# EasyEDA schematic Photogate1.json
TITLE: Sheet_1; REV: 1.0; Date: 2023-07-29; Sheet: 1/1; Drawn By: iwmain; Company: Your Company
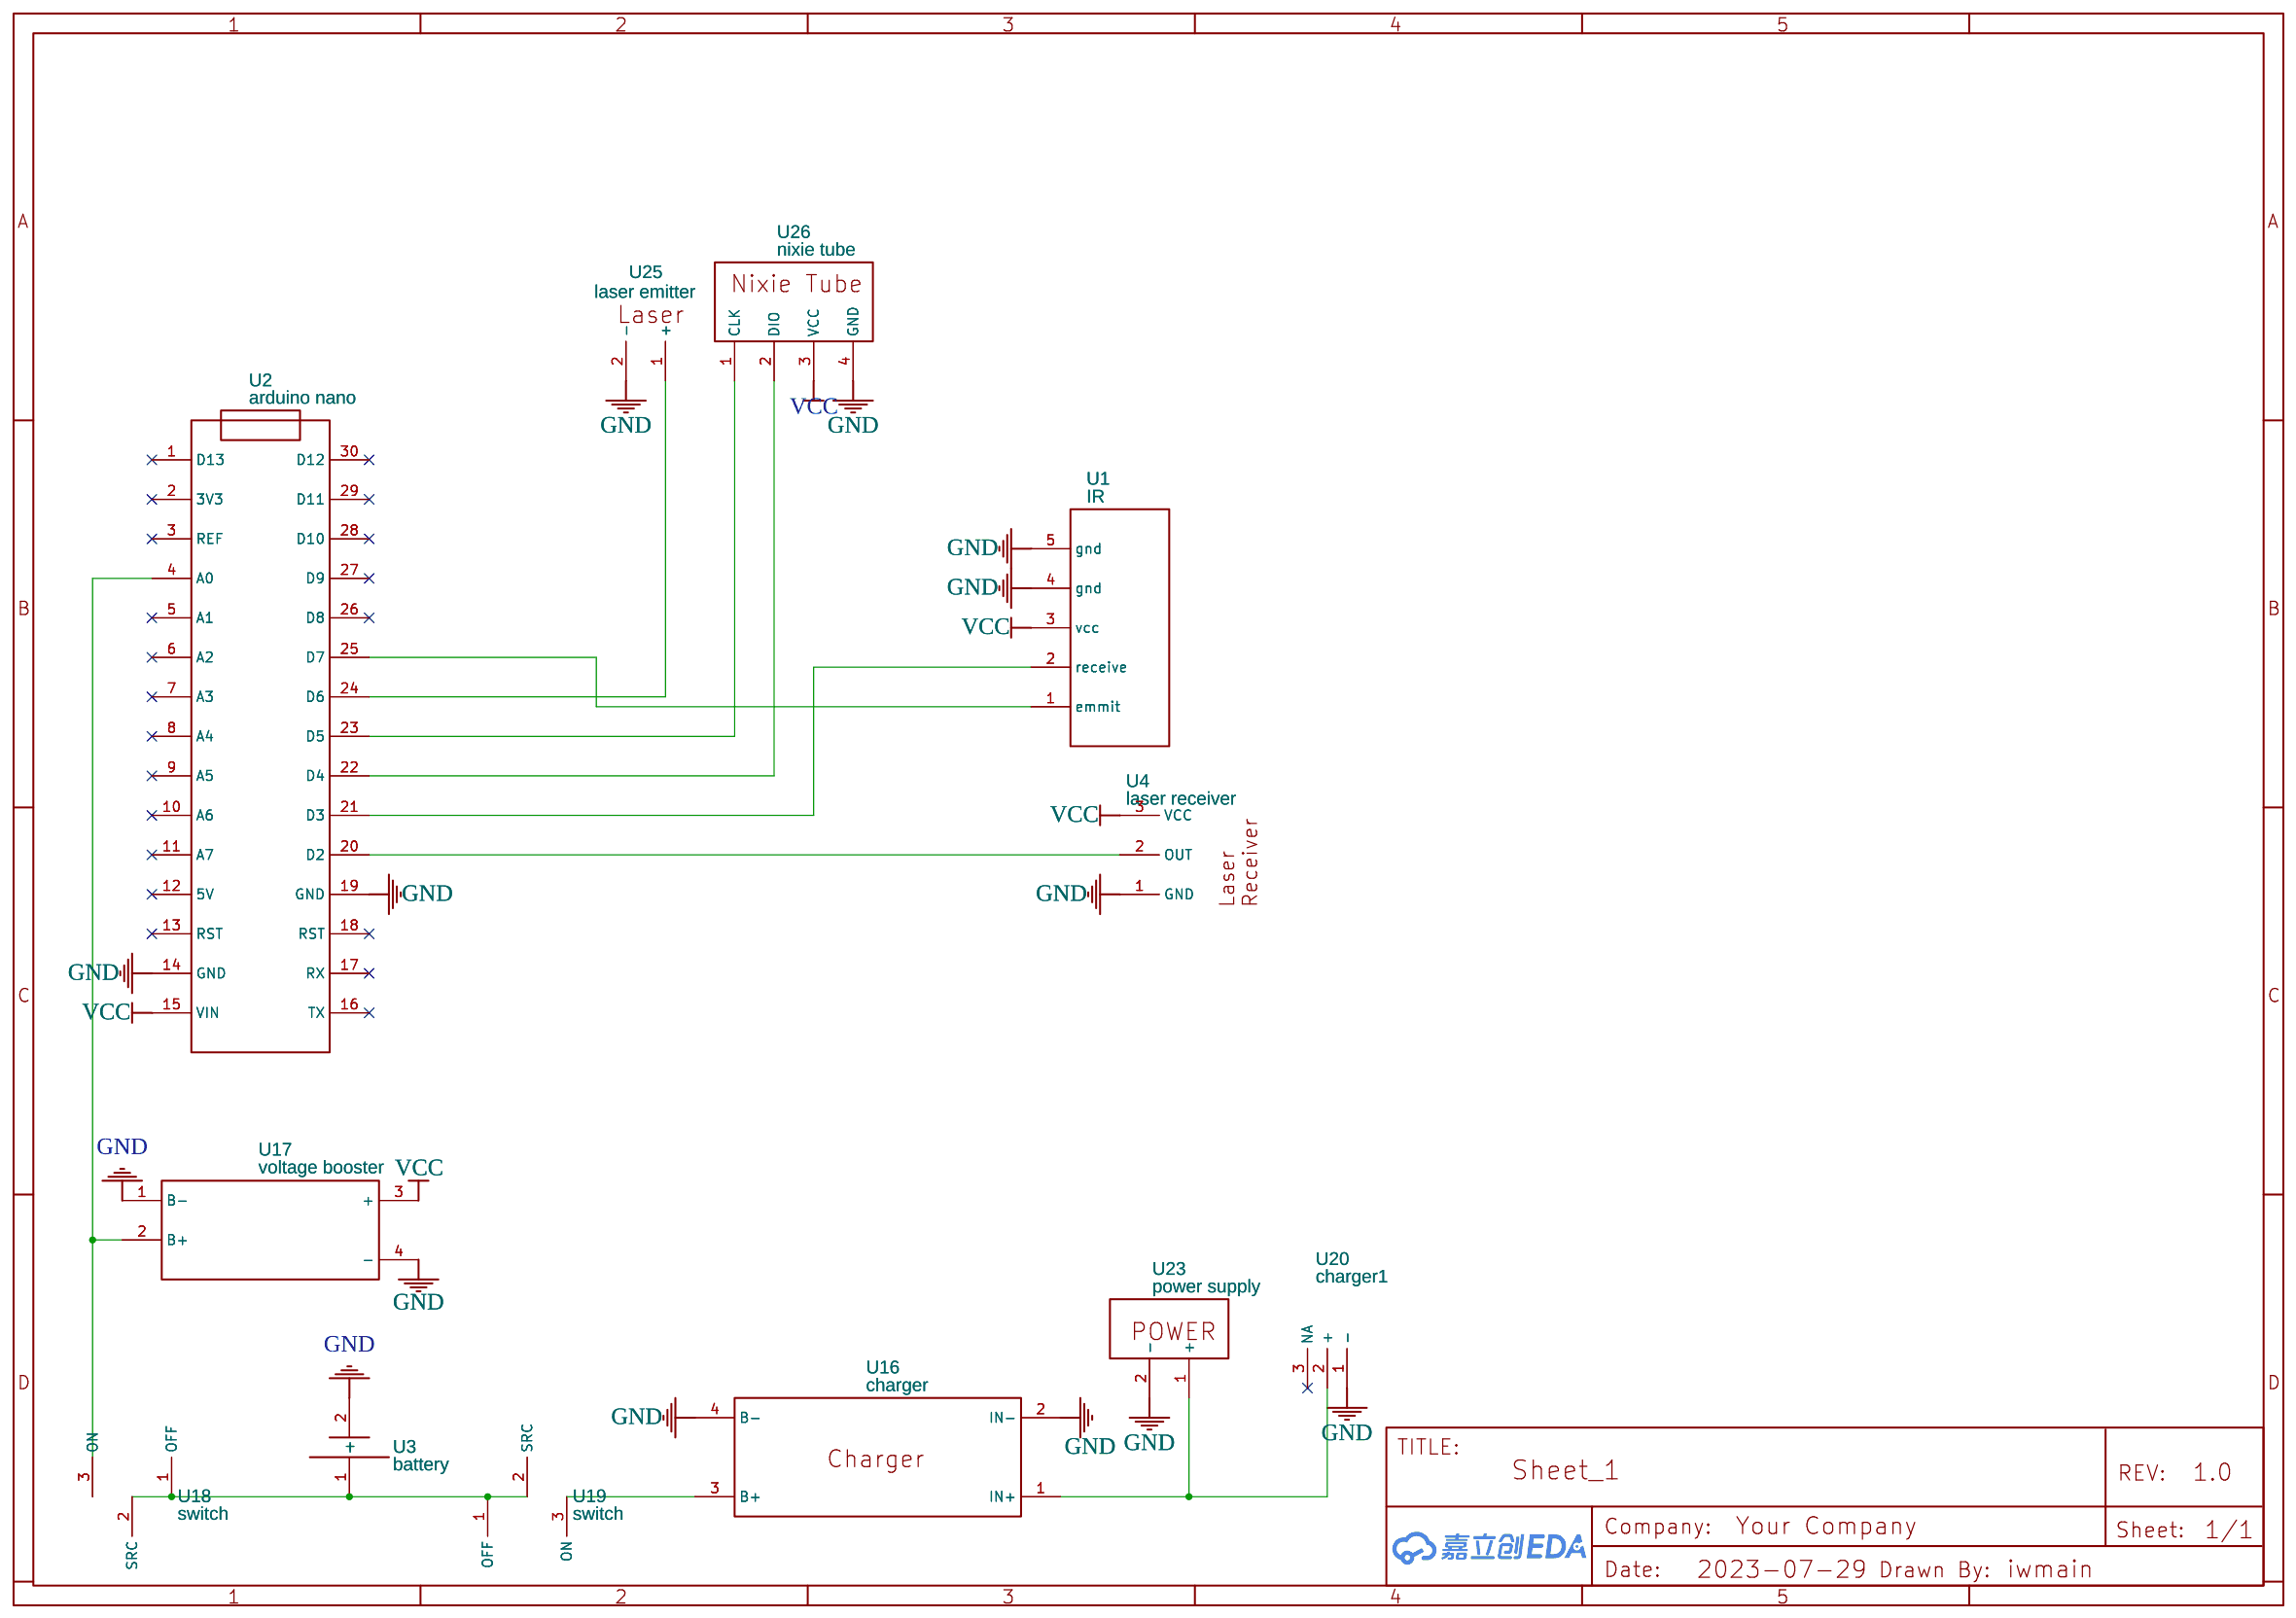
[diagram p0: schematic sheet]

## Parts
U1  IR  [IR]
U2  arduino nano  [ARDUINO NANO]
U3  battery  [BATTERY]
U4  laser receiver  [LASER RECEIVER]
U16  charger  [CHARGER]
U17  voltage booster  [VOLTAGE BOOSTER]
U18  switch  [SWITCH]
U19  switch  [SWITCH]
U20  charger1  [CHARGER1]
U23  power supply  [POWER SUPPLY]
U25  laser emitter  [LASER EMITTER]
U26  nixie tube  [NIXIE TUBE]

## Library data of the parts
U1 = IR: Contributor: iwmain
U2 = arduino nano: Contributor: iwmain
U3 = battery: Contributor: iwmain
U4 = laser receiver: Contributor: iwmain
U16 = charger: Contributor: iwmain
U17 = voltage booster: Contributor: iwmain
U18 U19 = switch: Contributor: iwmain
U20 = charger1: Contributor: iwmain
U23 = power supply: Contributor: iwmain
U25 = laser emitter: Contributor: iwmain
U26 = nixie tube: Contributor: iwmain

## Nets
GND: U1.4(gnd) U1.5(gnd) U2.14(GND) U2.19(GND) U3.2(-) U4.1(GND) U16.2(IN-) U16.4(B-) U17.1(B-) U17.4(-) U20.1(-) U23.2(-) U25.2(-) U26.4(GND)
VCC: U1.3(vcc) U2.15(VIN) U4.3(VCC) U17.3(+) U26.3(VCC)
Net-(U1-1): U1.1(emmit) U2.25(D7)
Net-(U1-2): U1.2(receive) U2.21(D3)
Net-(U2-4): U2.4(A0) U17.2(B+) U18.3(ON)
Net-(U2-20): U2.20(D2) U4.2(OUT)
Net-(U2-22): U2.22(D4) U26.2(DIO)
Net-(U2-23): U2.23(D5) U26.1(CLK)
Net-(U2-24): U2.24(D6) U25.1(+)
Net-(U3-1): U3.1(+) U18.1(OFF) U18.2(SRC) U19.1(OFF) U19.2(SRC)
Net-(U16-1): U16.1(IN+) U20.2(+) U23.1(+)
Net-(U16-3): U16.3(B+) U19.3(ON)

Not connected (* = marked no-connect by the designer): U2 1(D13)* 2(3V3)* 3(REF)* 5(A1)* 6(A2)* 7(A3)* 8(A4)* 9(A5)* 10(A6)* 11(A7)* 12(5V)* 13(RST)* 16(TX)* 17(RX)* 18(RST)* 26(D8)* 27(D9)* 28(D10)* 29(D11)* 30(D12)*; U20 3(NA)*
